# Altium project Voltage_Isolator.PrjPcb
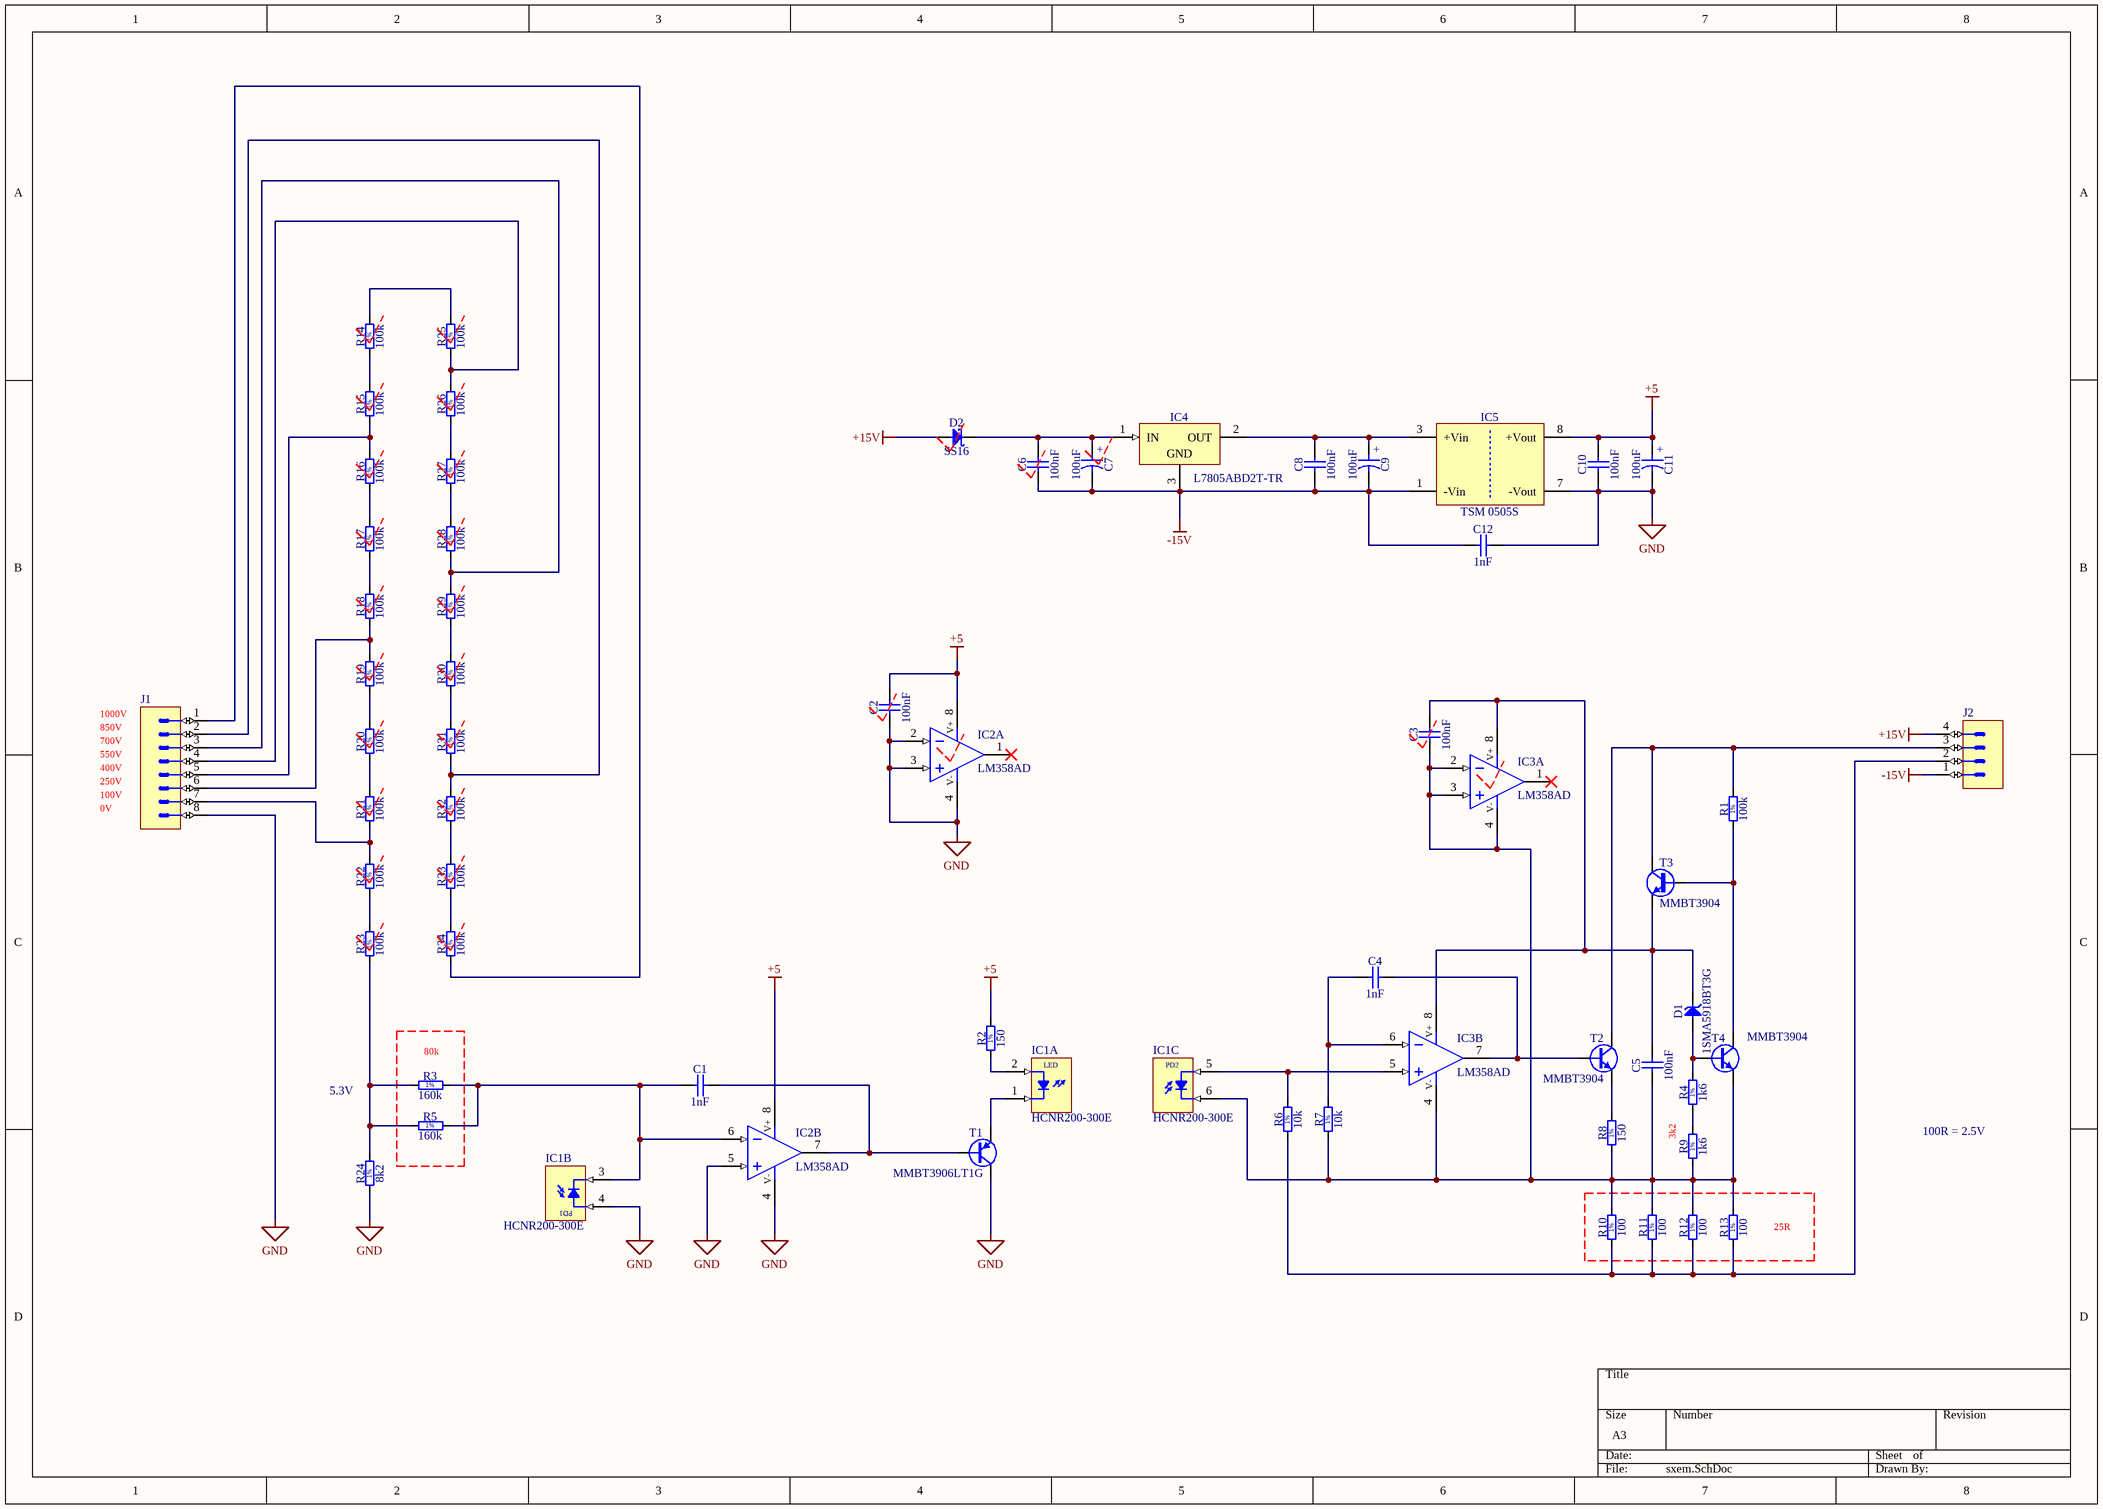
[diagram p0: sxem.SchDoc]
1 sheet, 59 parts. Net scope: global (net labels, ports and power ports of the same name join across sheets).
Board files: pcb.PcbDoc, panel.PcbDoc

## Sheet sxem.SchDoc
size A3; SheetNumber: 1; SheetTotal: 1

### Parts
C1  1nF  [CAPC3216X140N]
C2  100nF  [CAPC3216X140N]
C3  100nF  [CAPC3216X140N]
C4  1nF  [CAPC3216X140N]
C5  100nF  [CAPC3216X140N]
C6  100nF  [CAPC3216X140N]
C7  100uF  [CAPPR250-680X1250]
C8  100nF  [CAPC3216X140N]
C9  100uF  [CAPPR250-680X1080]
C10  100nF  [CAPC3216X140N]
C11  100uF  [CAPPR250-680X1080]
C12  1nF  [CAPRB_MURATA_DHR4E4C102K2FB]
D1  1SMA5918BT3G  [DIOM5226X230N]
D2  SS16  [DIOM5127X229N]
IC1  HCNR200-300E  [AVAGO_HCNR200-300E]  (parts A,B,C of 3)
IC2  LM358AD  [SOIC127P600X175-8N]  (parts A,B of 2)
IC3  LM358AD  [SOIC127P600X175-8N]  (parts A,B of 2)
IC4  L7805ABD2T-TR  [TO254P1542X460-3N-R790X1040]
IC5  TSM 0505S  [SOIC127P1110X695-8_14N]
J1  (no value)  [PHOENIX_1757307]
J2  (no value)  [PHOENIX_1757268]
R1  100k  [RESC3216X65N]
R2  150  [RESC3216X65N]
R3  160k  [RESC3216X65N]
R4  1k6  [RESC3216X65N]
R5  160k  [RESC3216X65N]
R6  10k  [RESC3216X65N]
R7  10k  [RESC3216X65N]
R8  150  [RESC3216X65N]
R9  1k6  [RESC3216X65N]
R10  100  [RESC3216X65N]
R11  100  [RESC3216X65N]
R12  100  [RESC3216X65N]
R13  100  [RESC3216X65N]
R14  100k  [RESC3216X65N]
R15  100k  [RESC3216X65N]
R16  100k  [RESC3216X65N]
R17  100k  [RESC3216X65N]
R18  100k  [RESC3216X65N]
R19  100k  [RESC3216X65N]
R20  100k  [RESC3216X65N]
R21  100k  [RESC3216X65N]
R22  100k  [RESC3216X65N]
R23  100k  [RESC3216X65N]
R24  8k2  [RESC3216X65N]
R25  100k  [RESC3216X65N]
R26  100k  [RESC3216X65N]
R27  100k  [RESC3216X65N]
R28  100k  [RESC3216X65N]
R29  100k  [RESC3216X65N]
R30  100k  [RESC3216X65N]
R31  100k  [RESC3216X65N]
R32  100k  [RESC3216X65N]
R33  100k  [RESC3216X65N]
R34  100k  [RESC3216X65N]
T1  MMBT3906LT1G  [SOT95P240X110-3N]
T2  MMBT3904  [SOT95P230X110-3N]
T3  MMBT3904  [SOT95P230X110-3N]
T4  MMBT3904  [SOT95P230X110-3N]

### Blocks framed on the sheet
80k: R3 R5
25R: R10-R13

### Nets
+5: C2.2 C10.2 C11.1 IC2.8(V+) IC5.8(+Vout) R2.2
+15V: D2.2(A) J2.4
-15V: C6.1 C7.2 C8.1 C9.2 C12.1 IC4.3(GND) IC5.1(-Vin) J2.1
GND: C2.1 C10.1 C11.2 C12.2 IC1.4(A) IC2.2(IN-) IC2.3(IN+) IC2.4(V-) IC2.5(IN+) IC5.7(-Vout) J1.8 R24.1 T1.3(C)
NetC1_1: C1.1 IC1.3(C) IC2.6(IN-) R3.2 R5.2
NetC1_2: C1.2 IC2.7(OUT) T1.1(B)
NetC3_1: C3.1 C5.1 IC1.6(C) IC3.2(IN-) IC3.3(IN+) IC3.4(V-) R7.1 R8.1 R9.1 R10.2 R11.2 R12.2 R13.2 T4.2(E)
NetC3_2: C3.2 C5.2 D1.1(C) IC3.8(V+) T3.2(E)
NetC4_1: C4.1 IC3.6(IN-) R7.2
NetC4_2: C4.2 IC3.7(OUT) T2.1(B)
NetC6_2: C6.2 C7.1 D2.1(C) IC4.1(IN)
NetC8_2: C8.2 C9.1 IC4.2(OUT) IC5.3(+Vin)
NetD1_2: D1.2(A) R4.2 T4.1(B)
NetIC1_1: IC1.1(C) T1.2(E)
NetIC1_2: IC1.2(A) R2.1
NetIC1_5: IC1.5(A) IC3.5(IN+) R6.2
NetJ1_1: J1.1 R34.1
NetJ1_2: J1.2 R31.1 R32.2
NetJ1_3: J1.3 R28.1 R29.2
NetJ1_4: J1.4 R25.1 R26.2
NetJ1_5: J1.5 R15.1 R16.2
NetJ1_6: J1.6 R18.1 R19.2
NetJ1_7: J1.7 R21.1 R22.2
NetJ2_2: J2.2 R6.1 R10.1 R11.1 R12.1 R13.1
NetJ2_3: J2.3 R1.2 T2.3(C) T3.3(C)
NetR1_1: R1.1 T3.1(B) T4.3(C)
NetR3_1: R3.1 R5.1 R23.1 R24.2
NetR4_1: R4.1 R9.2
NetR8_2: R8.2 T2.2(E)
NetR14_1: R14.1 R15.2
NetR14_2: R14.2 R25.2
NetR16_1: R16.1 R17.2
NetR17_1: R17.1 R18.2
NetR19_1: R19.1 R20.2
NetR20_1: R20.1 R21.2
NetR22_1: R22.1 R23.2
NetR26_1: R26.1 R27.2
NetR27_1: R27.1 R28.2
NetR29_1: R29.1 R30.2
NetR30_1: R30.1 R31.2
NetR32_1: R32.1 R33.2
NetR33_1: R33.1 R34.2

Not connected (* = marked no-connect by the designer): IC2 1(OUT)*; IC3 1(OUT)*

### Notes on the sheet
- 1000V
- 250V
- 400V
- 550V
- 700V
- 850V
- 0V
- 100V
- 5.3V
- (near R9) 3k2
- 100R = 2.5V
- (in symbol CAER_100UF_16V_20%_CHEMI-CON_APSA160ELL101MFA5G) +
- (in symbol CAER_100UF_25V_20%_NICHICON_UPS1E101MED) +
- (in symbol HCNR200-300E, part A) LED
- (in symbol HCNR200-300E, part B) PD1
- (in symbol HCNR200-300E, part C) PD2
- (in symbol R1206_1K6_1%_0.25W_100PPM) 1%
- (in symbol R1206_8K2_1%_0.25W_100PPM) 1%
- (in symbol R1206_10K_1%_0.25W_100PPM) 1%
- (in symbol R1206_100K_1%_0.25W_100PPM) 1%
- (in symbol R1206_100R_1%_0.25W_100PPM) 1%
- (in symbol R1206_150R_1%_0.25W_100PPM) 1%
- (in symbol R1206_160K_1%_0.25W_100PPM) 1%

### Library data of the parts
C1 C4 = CC1206_1NF_100V_5%_NP0: Non-polarised capacitor; Part Description: SMD Multilayer Chip Ceramic Capacitor; Manufacturer: GENERIC; Manufacturer1 Part Number: 12061A102JAT2A; Voltage: 100V; TC: C0G/NP0; Tolerance: ±5%; Part Number: CC1206_1NF_100V_5%_NP0; Component Kind: Standard; Component Type: Standard; Pin Count: 2; Value: 1nF; Status: Preferred; Manufacturer Part Number: CC1206_1NF_100V_5%_NP0; Case: 1206; Mounted: Yes; Socket: No; SMD: Yes; Sense: No; Manufacturer1 Example: AVX; Manufacturer1 ComponentHeight: 0.94mm; HelpURL: \\cern.ch\dfs\Applications\Altium\Datasheets\CC1206_NP0_AVX.pdf; Author: CERN DEM JLC; CreateDate: 06.04.2011; LatestRevisionDate: 06.04.2011
C2 C3 C5 C6 C8 C10 = CC1206_100NF_100V_10%_X7R: Non-polarised capacitor; Part Description: SMD Multilayer Chip Ceramic Capacitor; Manufacturer: GENERIC; Manufacturer1 Part Number: 222260115649; Voltage: 100V; TC: X7R; Tolerance: ±10%; Part Number: CC1206_100NF_100V_10%_X7R; Component Kind: Standard; Component Type: Standard; Pin Count: 2; Value: 100nF; Status: Preferred; Manufacturer Part Number: CC1206_100NF_100V_10%_X7R; Case: 1206; Mounted: Yes; Socket: No; SMD: Yes; Sense: No; Manufacturer1 Example: PHYCOMP; Manufacturer1 ComponentHeight: 1.25mm; HelpURL: \\cern.ch\dfs\Applications\Altium\Datasheets\CC1206_X7R_PHYCOMP.pdf; Author: CERN DEM JLC; CreateDate: 24.08.2009; LatestRevisionDate: 24.08.2009
C7 = CAER_100UF_25V_20%_NICHICON_UPS1E101MED: Polarised capacitor; Part Description: Aluminium Electrolytic Capacitor (UPS Series); Voltage: 25V; Tolerance: ±20%; Part Number: CAER_100UF_25V_20%_NICHICON_UPS1E101MED; Component Kind: Standard; Component Type: Standard; Pin Count: 2; Value: 100uF; Status: None; Manufacturer: NICHICON; Manufacturer Part Number: UPS1E101MED; Case: LS2.5 D6.3 x H11; Mounted: Yes; Socket: No; SMD: No; Sense: No; ComponentHeight: 12.5mm; HelpURL: \\cern.ch\dfs\Applications\Altium\Datasheets\CAER_NICHICON_UPS.pdf; Author: CERN DEM MR; CreateDate: 30.05.2016; LatestRevisionDate: 30.05.2016
C9 C11 = CAER_100UF_16V_20%_CHEMI-CON_APSA160ELL101MFA5G: Polarised capacitor; Part Description: Low ESR 0R025 Conductive Polymer Aluminium Solid Capacitor; Manufacturer: UNITED CHEMI-CON; Voltage: 16V; Tolerance: ±20%; Part Number: CAER_100UF_16V_20%_CHEMI-CON_APSA160ELL101MFA5G; Component Kind: Standard; Component Type: Standard; Pin Count: 2; Value: 100uF; Status: None; Manufacturer Part Number: APSA160ELL101MFA5G; Case: LS2.5 D6.3 x H10.5; Mounted: Yes; Socket: No; SMD: No; Sense: No; ComponentHeight: 10.8mm; HelpURL: \\cern.ch\dfs\Applications\Altium\Datasheets\CAER_CHEMI-CON_PSA.pdf; Author: CERN DEM JLC; CreateDate: 12.01.2012; LatestRevisionDate: 12.01.2012
C12 = CCR_1NF_15KV_10%_MURATA_DHR4E4C102K2FB: Non-polarised capacitor; Part Description: High Voltage Ceramic Capacitor; Manufacturer: MURATA; Voltage: 15kV; Tolerance: ±10%; Part Number: CCR_1NF_15KV_10%_MURATA_DHR4E4C102K2FB; Component Kind: Standard; Component Type: Standard; Pin Count: 2; Value: 1nF; Status: None; Manufacturer Part Number: DHR4E4C102K2FB; Case: LS12.7 W8.2 x D18; Mounted: Yes; Socket: No; SMD: No; Sense: No; ComponentHeight: 22mm; HelpURL: \\cern.ch\dfs\Applications\Altium\Datasheets\CCR_MURATA_DHR4E4C102K2FB.pdf; Author: CERN DEM JLC; CreateDate: 08.05.2014; LatestRevisionDate: 08.05.2014
D1 = 1SMA5918BT3G: Zener Diode; Part Description: Zener Voltage Regulators; Manufacturer: ON SEMICONDUCTOR; Voltage: 5.1V; Power: 1.5W; PressFit: No; Bonding: No; Part Number: 1SMA5918BT3G; Component Kind: Standard; Component Type: Standard; Device: 1SMA5918BT3G; Footprint: DIOM5226X220N; PackageDescription: DO-214-AC/SMA Diode, Molded Body; 5.21mm L X 2.60mm W X 2.20mm H, IPC Medium Density; Manufacturer Part Number: 1SMA5918BT3G; Pin Count: 2; Case: DO-214AC; Mounted: Yes; Socket: No; SMD: Yes; Sense: No; ComponentHeight: 2.20mm; HelpURL: \\cern.ch\dfs\Applications\Altium\Datasheets\1SMA5918BT3G.pdf; Author: CERN DEM JLC; CreateDate: 16.02.2012; LatestRevisionDate: 16.02.2012
D2 = SS16: Schottky Diode; Part Description: Surface Mount Schottky Barrier Rectifier; Manufacturer: VISHAY GENERAL SEMICONDUCTOR; Voltage: 60V; Power: 1A; PressFit: No; Bonding: No; Part Number: SS16; Component Kind: Standard; Component Type: Standard; Device: SS16; PackageDescription: DO-214-AC Molded Diode, Body 5.1x2.7mm, IPC Medium Density; Manufacturer Part Number: SS16; Pin Count: 2; Case: DO-214AC; Mounted: Yes; Socket: No; SMD: Yes; Sense: No; ComponentHeight: 2.29mm; HelpURL: \\cern.ch\dfs\Applications\Altium\Datasheets\SS16.pdf; Author: CERN DEM JLC; CreateDate: 15.07.2008; LatestRevisionDate: 23.08.2010
IC1 = HCNR200-300E: High-Linearity Analog Optocoupler; Manufacturer: AVAGO TECHNOLOGIES; PressFit: No; Bonding: No; Part Number: HCNR200-300E; Component Kind: Standard; Component Type: Standard; Device: HCNR200-300E; PackageDescription: DIP8 Gull Wing Surface Mount, 8-Leads, Body 11.15x9mm, Pitch 2.54mm; Part Description: High-Linearity Analog Optocoupler; Manufacturer Part Number: HCNR200-300E; Pin Count: 8; Case: SOIC8; Mounted: Yes; Socket: No; SMD: Yes; Sense: No; ComponentHeight: 3.3mm; HelpURL: \\cern.ch\dfs\Applications\Altium\Datasheets\HCNR200-300E.pdf; Author: CERN DEM JLC; CreateDate: 05.07.2011; LatestRevisionDate: 05.07.2011
IC2 IC3 = LM358AD: Dual Operational Amplifier; Manufacturer: TEXAS INSTRUMENTS; PressFit: No; Bonding: No; Part Number: LM358AD; Component Kind: Standard; Component Type: Standard; Device: LM358AD; PackageDescription: SOIC 8, Pitch 1.27mm - Body 4x5mm, IPC Medium Density; Part Description: Dual Operational Amplifier; Manufacturer Part Number: LM358AD; Pin Count: 8; Case: SOIC8; Mounted: Yes; Socket: No; SMD: Yes; Sense: No; ComponentHeight: 1.75mm; Author: CERN DEM JLC; HelpURL: \\cern.ch\dfs\Applications\Altium\Datasheets\LM358AD.pdf; CreateDate: 02.12.2008; LatestRevisionDate: 13.04.2010
IC4 = L7805ABD2T-TR: 3-Terminal Regulator 1=IN 2=OUT 3=GND; Part Description: 5V 1.5A Positive Voltage Regulator; Manufacturer: ST MICROELECTRONICS; PressFit: No; Bonding: No; Part Number: L7805ABD2T-TR; Component Kind: Standard; Component Type: Standard; Device: L7805ABD2T-TR; PackageDescription: D2PAK TO-263, TO, 2.54mm pitch; 2 pin,15.425mm L X 9.15mm W X 4.60mm H body, IPC Medium Density; Manufacturer Part Number: L7805ABD2T-TR; Pin Count: 3; Case: TO-263; Mounted: Yes; Socket: No; SMD: Yes; Sense: No; ComponentHeight: 4.6mm; HelpURL: \\cern.ch\dfs\Applications\Altium\Datasheets\L7805ABD2T-TR.pdf; Author: CERN DEM JLC; CreateDate: 13.12.2011; LatestRevisionDate: 13.12.2011
IC5 = TSM 0505S: TRACO, TSM Serie, Single Output DCDC Converter; Part Description: 5V ±10% to 5V, Iout (max) 200mA, 1W DC-DC Converter; Manufacturer: TRACO POWER; PressFit: No; Bonding: No; Part Number: TSM 0505S; Component Kind: Standard; Component Type: Standard; Device: TSM 0505S; PackageDescription: SOIC, 1.27mm, pitch; 8 of 14 pin, 8.00mm W X 12.35mm L X 6.95mm H body, IPC Medium Density; Manufacturer Part Number: TSM 0505S; Pin Count: 4; Mounted: Yes; Socket: No; SMD: Yes; Sense: No; ComponentHeight: 6.95mm; HelpURL: \\cern.ch\dfs\Applications\Altium\Datasheets\TSM 0505S.pdf; Author: CERN DEM JLC; CreateDate: 10.05.2010; LatestRevisionDate: 10.05.2010
J1 = PHOENIX_1757307: Connector 8 Male; Part Description: 12A, 250V, Pitch 5.08mm, 8 Positions Header; Manufacturer: PHOENIX CONTACT; Manufacturer Part Number: 1757307 (MSTBA 2,5/ 8-G-5,08); PressFit: No; Part Number: PHOENIX_1757307; Component Kind: Standard; Component Type: Standard; Pin Count: 8; Mounted: Yes; Socket: No; SMD: No; Sense: No; Status: None; ComponentHeight: 8.6mm; HelpURL: \\cern.ch\dfs\Applications\Altium\Datasheets\PHOENIX_1757307.pdf; Author: CERN DEM JLC; CreateDate: 10.02.2010; LatestRevisionDate: 26.04.2010
J2 = PHOENIX_1757268: Connector 4 Male; Part Description: 12A, 250V, Pitch 5.08mm, 4 Positions Header; Manufacturer: PHOENIX CONTACT; Manufacturer Part Number: 1757268 (MSTBA 2,5/ 4-G-5,08); PressFit: No; Part Number: PHOENIX_1757268; Component Kind: Standard; Component Type: Standard; Pin Count: 4; Mounted: Yes; Socket: No; SMD: No; Sense: No; Status: None; ComponentHeight: 8.6mm; HelpURL: \\cern.ch\dfs\Applications\Altium\Datasheets\PHOENIX_1757268.pdf; Author: CERN DEM JLC; CreateDate: 10.02.2010; LatestRevisionDate: 26.04.2010
R1 R14-R23 R25-R34 = R1206_100K_1%_0.25W_100PPM: Resistor - 1%; Part Description: General Purpose Thick Film Chip Resistor; Manufacturer: GENERIC; Manufacturer1 Part Number: NRC12F1003TRF; Power: 0.25W; TC: ±100ppm/°C; PressFit: No; Part Number: R1206_100K_1%_0.25W_100PPM; Component Kind: Standard; Component Type: Standard; Pin Count: 2; Value: 100k; Status: Preferred; Tolerance: ±1%; Manufacturer Part Number: R1206_100K_1%_0.25W_100PPM; Case: 1206; Mounted: Yes; Sense: No; Socket: No; SMD: Yes; Manufacturer1 Example: NIC COMPONENT; Manufacturer1 ComponentHeight: 0.65mm; HelpURL: \\cern.ch\dfs\Applications\Altium\Datasheets\R1206_NIC_NRC.pdf; Author: CERN DEM JLC; CreateDate: 03.12.2007; LatestRevisionDate: 13.03.2008
R2 R8 = R1206_150R_1%_0.25W_100PPM: Resistor - 1%; Part Description: General Purpose Thick Film Chip Resistor; Manufacturer: GENERIC; Manufacturer1 Part Number: NRC12F1500TRF; Power: 0.25W; TC: ±100ppm/°C; PressFit: No; Part Number: R1206_150R_1%_0.25W_100PPM; Component Kind: Standard; Component Type: Standard; Pin Count: 2; Value: 150; Status: Preferred; Tolerance: ±1%; Manufacturer Part Number: R1206_150R_1%_0.25W_100PPM; Case: 1206; Mounted: Yes; Sense: No; Socket: No; SMD: Yes; Manufacturer1 Example: NIC COMPONENT; Manufacturer1 ComponentHeight: 0.65mm; HelpURL: \\cern.ch\dfs\Applications\Altium\Datasheets\R1206_NIC_NRC.pdf; Author: CERN DEM JLC; CreateDate: 03.12.2007; LatestRevisionDate: 13.03.2008
R3 R5 = R1206_160K_1%_0.25W_100PPM: Resistor - 1%; Part Description: General Purpose Thick Film Chip Resistor; Manufacturer: GENERIC; Manufacturer1 Part Number: NRC12F1603TRF; Power: 0.25W; TC: ±100ppm/°C; PressFit: No; Part Number: R1206_160K_1%_0.25W_100PPM; Component Kind: Standard; Component Type: Standard; Pin Count: 2; Value: 160k; Status: Preferred; Tolerance: ±1%; Manufacturer Part Number: R1206_160K_1%_0.25W_100PPM; Case: 1206; Mounted: Yes; Sense: No; Socket: No; SMD: Yes; Manufacturer1 Example: NIC COMPONENT; Manufacturer1 ComponentHeight: 0.65mm; HelpURL: \\cern.ch\dfs\Applications\Altium\Datasheets\R1206_NIC_NRC.pdf; Author: CERN DEM JLC; CreateDate: 03.12.2007; LatestRevisionDate: 13.03.2008
R4 R9 = R1206_1K6_1%_0.25W_100PPM: Resistor - 1%; Part Description: General Purpose Thick Film Chip Resistor; Manufacturer: GENERIC; Manufacturer1 Part Number: NRC12F1601TRF; Power: 0.25W; TC: ±100ppm/°C; PressFit: No; Part Number: R1206_1K6_1%_0.25W_100PPM; Component Kind: Standard; Component Type: Standard; Pin Count: 2; Value: 1k6; Status: Preferred; Tolerance: ±1%; Manufacturer Part Number: R1206_1K6_1%_0.25W_100PPM; Case: 1206; Mounted: Yes; Sense: No; Socket: No; SMD: Yes; Manufacturer1 Example: NIC COMPONENT; Manufacturer1 ComponentHeight: 0.65mm; HelpURL: \\cern.ch\dfs\Applications\Altium\Datasheets\R1206_NIC_NRC.pdf; Author: CERN DEM JLC; CreateDate: 03.12.2007; LatestRevisionDate: 13.03.2008
R6 R7 = R1206_10K_1%_0.25W_100PPM: Resistor - 1%; Part Description: General Purpose Thick Film Chip Resistor; Manufacturer: GENERIC; Manufacturer1 Part Number: NRC12F1002TRF; Power: 0.25W; TC: ±100ppm/°C; PressFit: No; Part Number: R1206_10K_1%_0.25W_100PPM; Component Kind: Standard; Component Type: Standard; Pin Count: 2; Value: 10k; Status: Preferred; Tolerance: ±1%; Manufacturer Part Number: R1206_10K_1%_0.25W_100PPM; Case: 1206; Mounted: Yes; Sense: No; Socket: No; SMD: Yes; Manufacturer1 Example: NIC COMPONENT; Manufacturer1 ComponentHeight: 0.65mm; HelpURL: \\cern.ch\dfs\Applications\Altium\Datasheets\R1206_NIC_NRC.pdf; Author: CERN DEM JLC; CreateDate: 03.12.2007; LatestRevisionDate: 13.03.2008
R10-R13 = R1206_100R_1%_0.25W_100PPM: Resistor - 1%; Part Description: General Purpose Thick Film Chip Resistor; Manufacturer: GENERIC; Manufacturer1 Part Number: NRC12F4700TRF; Power: 0.25W; TC: ±100ppm/°C; PressFit: No; Part Number: R1206_100R_1%_0.25W_100PPM; Component Kind: Standard; Component Type: Standard; Pin Count: 2; Value: 100; Status: Preferred; Tolerance: ±1%; Manufacturer Part Number: R1206_100R_1%_0.25W_100PPM; Case: 1206; Mounted: Yes; Sense: No; Socket: No; SMD: Yes; Manufacturer1 Example: NIC COMPONENT; Manufacturer1 ComponentHeight: 0.65mm; HelpURL: \\cern.ch\dfs\Applications\Altium\Datasheets\R1206_NIC_NRC.pdf; Author: CERN DEM JLC; CreateDate: 03.12.2007; LatestRevisionDate: 13.03.2008
R24 = R1206_8K2_1%_0.25W_100PPM: Resistor - 1%; Part Description: General Purpose Thick Film Chip Resistor; Manufacturer: GENERIC; Manufacturer1 Part Number: NRC12F8201TRF; Power: 0.25W; TC: ±100ppm/°C; PressFit: No; Part Number: R1206_8K2_1%_0.25W_100PPM; Component Kind: Standard; Component Type: Standard; Pin Count: 2; Value: 8k2; Status: Preferred; Tolerance: ±1%; Manufacturer Part Number: R1206_8K2_1%_0.25W_100PPM; Case: 1206; Mounted: Yes; Sense: No; Socket: No; SMD: Yes; Manufacturer1 Example: NIC COMPONENT; Manufacturer1 ComponentHeight: 0.65mm; HelpURL: \\cern.ch\dfs\Applications\Altium\Datasheets\R1206_NIC_NRC.pdf; Author: CERN DEM JLC; CreateDate: 03.12.2007; LatestRevisionDate: 13.03.2008
T1 = MMBT3906LT1G: PNP Transistor; Part Description: 40V 200mA PNP General Purpose Transistor; Manufacturer: ON SEMICONDUCTOR; PressFit: No; Bonding: No; Part Number: MMBT3906LT1G; Component Kind: Standard; Component Type: Standard; Device: MMBT3906LT1G; PackageDescription: SOT23 3-Leads, Pitch 0.95mm - Body 1.4x3mm, IPC Medium Density; Manufacturer Part Number: MMBT3906LT1G; Pin Count: 3; Case: SOT23-3; Mounted: Yes; Socket: No; SMD: Yes; Sense: No; ComponentHeight: 1.1mm; HelpURL: \\cern.ch\dfs\Applications\Altium\Datasheets\MMBT3906LT1G.pdf; Author: CERN DEM JLC; CreateDate: 29.03.2012; LatestRevisionDate: 29.03.2012
T2-T4 = MMBT3904: NPN Transistor; Part Description: 40V 200mA NPN Switching Transistor; Manufacturer: NXP SEMICONDUCTORS; PressFit: No; Bonding: No; Part Number: MMBT3904; Component Kind: Standard; Component Type: Standard; Device: MMBT3904; PackageDescription: SOT23, 3 pin, Pitch 0.95mm - 1.3mm W X 2.9mm L X 1.1mm H, IPC Medium Density; Manufacturer Part Number: MMBT3904; Pin Count: 3; Case: SOT23-3; Mounted: Yes; Socket: No; SMD: Yes; Sense: No; ComponentHeight: 1.1mm; HelpURL: \\cern.ch\dfs\Applications\Altium\Datasheets\MMBT3904.pdf; Author: CERN DEM JLC; CreateDate: 10.02.2010; LatestRevisionDate: 10.02.2010